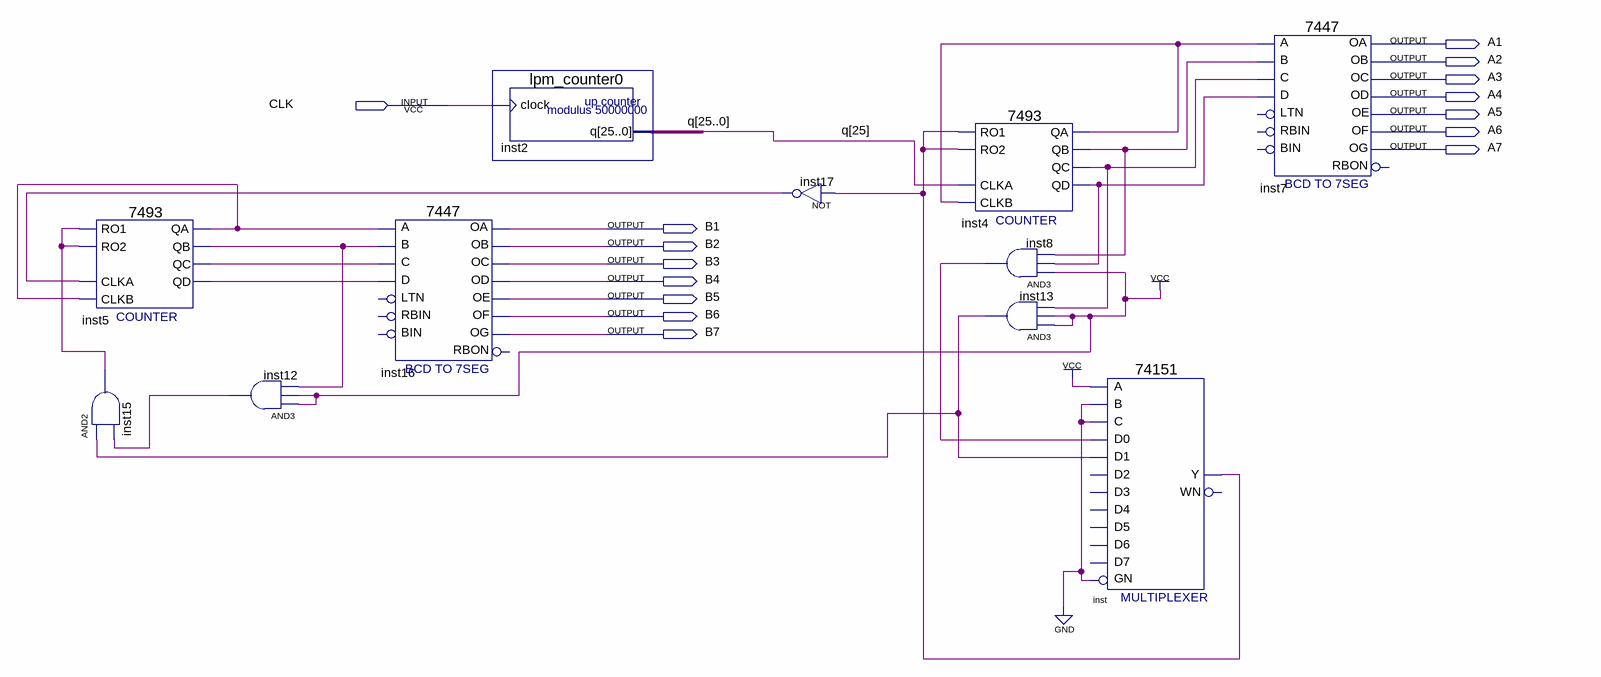
[diagram p0: schematic sheet]
// Quartus schematic ContadorHasta24.bdf as structural Verilog: 11 symbols, 15 pins
module ContadorHasta24 (
  input  CLK,
  output A1,
  output A2,
  output A3,
  output A4,
  output A5,
  output A6,
  output A7,
  output B1,
  output B2,
  output B3,
  output B4,
  output B5,
  output B6,
  output B7
);

  wire inst4_qa, inst4_qb, inst4_qc, inst4_qd, inst5_qa, inst5_qb, inst5_qc, inst5_qd, inst8_out, inst12_out,
       inst13_out, inst15_out, inst17_out, inst_y;
  wire [25:0] q;

  \7493  inst5 (
    .RO1(inst15_out), .RO2(inst15_out), .CLKA(inst17_out), .CLKB(inst5_qa), .QC(inst5_qc), .QB(inst5_qb),
    .QA(inst5_qa), .QD(inst5_qd));
  and inst15 (inst15_out, inst13_out, inst12_out);
  and inst12 (inst12_out, 1'b1, 1'b1, inst5_qb);
  \7447  inst16 (
    .B(inst5_qb), .C(inst5_qc), .D(inst5_qd), .A(inst5_qa), .OB(B2), .OC(B3), .OE(B5), .OD(B4), .OF(B6),
    .OG(B7), .OA(B1));  // open: LTN, RBIN, BIN, RBON
  lpm_counter0 inst2 (.clock(CLK), .q(q));
  not inst17 (inst17_out, inst_y);
  \7493  inst4 (
    .RO1(inst_y), .RO2(inst_y), .CLKA(q[25]), .CLKB(inst4_qa), .QC(inst4_qc), .QB(inst4_qb), .QA(inst4_qa),
    .QD(inst4_qd));
  and inst8 (inst8_out, 1'b1, inst4_qd, inst4_qb);
  and inst13 (inst13_out, 1'b1, 1'b1, inst4_qc);
  \74151  inst (
    .GN(1'b0), .C(1'b0), .B(1'b0), .A(1'b1), .D0(inst8_out), .D1(inst13_out), .Y(inst_y));  // open: D5, D4, D3, D2, D6, D7, WN
  \7447  inst7 (
    .B(inst4_qb), .C(inst4_qc), .D(inst4_qd), .A(inst4_qa), .OB(A2), .OC(A3), .OE(A5), .OD(A4), .OF(A6),
    .OG(A7), .OA(A1));  // open: LTN, RBIN, BIN, RBON
endmodule
